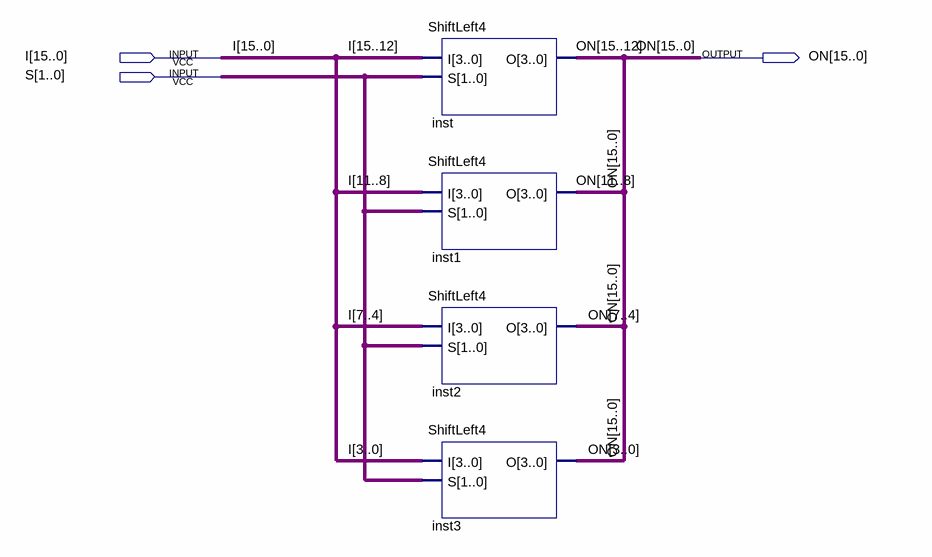
[diagram p0: schematic sheet]
// Quartus schematic BarrelShift_16.bdf as structural Verilog: 4 symbols, 3 pins
module BarrelShift_16 (
  input  [15:0] I,
  input  [1:0] S,
  output [15:0] ON
);

  ShiftLeft4 inst (.I(I[15:12]), .S(S), .O(ON[15:12]));
  ShiftLeft4 inst1 (.I(I[11:8]), .S(S), .O(ON[11:8]));
  ShiftLeft4 inst2 (.I(I[7:4]), .S(S), .O(ON[7:4]));
  ShiftLeft4 inst3 (.I(I[3:0]), .S(S), .O(ON[3:0]));
endmodule
